# EAGLE design TRC1.0.0 (EAGLE 9.6.2)
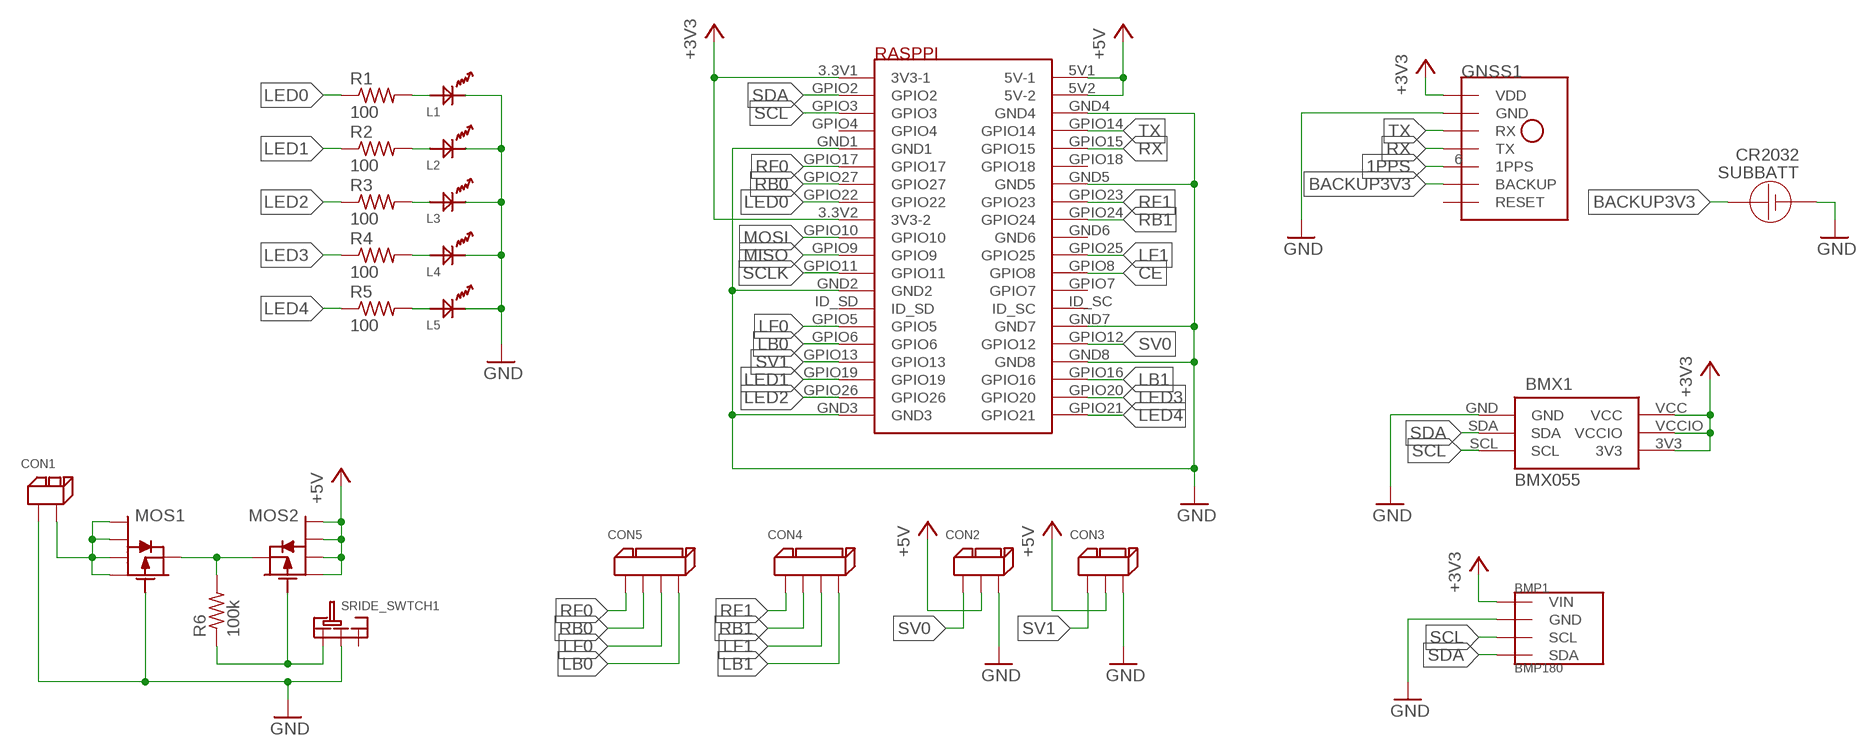
[diagram p0: schematic, sheet 1]

## Parts
BMP1  BMP180  [GY-68]
BMX1  BMX055  [BMX055]
CON1  2PIN  [2PIN]
CON2  3PIN  [3PIN]
CON3  3PIN  [3PIN]
CON4  4PIN  [4PIN]
CON5  4PIN  [4PIN]
GNSS1  GYSFDMAXB  [GYSFDMAXB]
L1  OSXX1608C1A  [OSXX1608C1A]
L2  OSXX1608C1A  [OSXX1608C1A]
L3  OSXX1608C1A  [OSXX1608C1A]
L4  OSXX1608C1A  [OSXX1608C1A]
L5  OSXX1608C1A  [OSXX1608C1A]
MOS1  PCH_SSM6J808R  [SSM6J808R]
MOS2  PCH_SSM6J808R  [SSM6J808R]
R1  100  R-US_R0201  [R0201]
R2  100  R-US_R0201  [R0201]
R3  100  R-US_R0201  [R0201]
R4  100  R-US_R0201  [R0201]
R5  100  R-US_R0201  [R0201]
R6  100k  R-US_R0201  [R0201]
RASPPI  RASPBERYPIZEROW  [RASPBERYPIZEROW]
SRIDE_SWTCH1  SRIDE_SWITCH  [SRIDE_SWITCH]
SUBBATT  CR2032  [CR2032]

## Nets
1PPS: GNSS1.6(1PPS)
+3V3: BMP1.P1(VIN) BMX1.3V3 BMX1.VCC BMX1.VCCIO GNSS1.16(VDD) RASPPI.3.3V1(3V3-1) RASPPI.3.3V2(3V3-2)
+5V: CON2.P$2 CON3.P$2 MOS2.1 MOS2.2 MOS2.5 MOS2.6 RASPPI.5V1(5V-1) RASPPI.5V2(5V-2)
BACKUP3V3: GNSS1.14(BACKUP) SUBBATT.VCC SUBBATT.VCC2(VCC)
CE: RASPPI.GPIO8
GND: BMP1.P2(GND) BMX1.GND CON1.P$1 CON2.P$3 CON3.P$3 GNSS1.1(GND) GNSS1.2(GND) GNSS1.7(GND) GNSS1.10(GND) GNSS1.12(GND) GNSS1.19(GND) GNSS1.20(GND) L1.CT L2.CT L3.CT L4.CT L5.CT MOS1.3 RASPPI.GND1 RASPPI.GND2 RASPPI.GND3 RASPPI.GND4 RASPPI.GND5 RASPPI.GND7 RASPPI.GND8 SRIDE_SWTCH1.LR SUBBATT.GND
LB0: CON5.P$4 RASPPI.GPIO6
LB1: CON4.P$4 RASPPI.GPIO16
LED0: R1.1 RASPPI.GPIO22
LED1: R2.1 RASPPI.GPIO19
LED2: R3.1 RASPPI.GPIO26
LED3: R4.1 RASPPI.GPIO20
LED4: R5.1 RASPPI.GPIO21
LF0: CON5.P$3 RASPPI.GPIO5
LF1: CON4.P$3 RASPPI.GPIO25
MISO: RASPPI.GPIO9
MOSI: RASPPI.GPIO10
N$1: L1.AN R1.2
N$2: L2.AN R2.2
N$3: L3.AN R3.2
N$4: L4.AN R4.2
N$5: L5.AN R5.2
N$6: MOS1.4 MOS2.4 R6.2
N$7: MOS2.3 R6.1 SRIDE_SWTCH1.L
N$8: CON1.P$2 MOS1.1 MOS1.2 MOS1.5 MOS1.6
RB0: CON5.P$2 RASPPI.GPIO27
RB1: CON4.P$2 RASPPI.GPIO24
RF0: CON5.P$1 RASPPI.GPIO17
RF1: CON4.P$1 RASPPI.GPIO23
RX: GNSS1.5(TX) RASPPI.GPIO15
SCL: BMP1.P3(SCL) BMX1.SCL RASPPI.GPIO3
SCLK: RASPPI.GPIO11
SDA: BMP1.P4(SDA) BMX1.SDA RASPPI.GPIO2
SV0: CON2.P$1 RASPPI.GPIO12
SV1: CON3.P$1 RASPPI.GPIO13
TX: GNSS1.3(RX) RASPPI.GPIO14
Unconnected: GNSS1.4(RESET) RASPPI.GND6 RASPPI.GPIO4 RASPPI.GPIO7 RASPPI.GPIO18 RASPPI.ID_SC RASPPI.ID_SD SRIDE_SWTCH1.R

## Library data of the parts
BMP1 = BMP180:BMP180
BMX1 = BMX055:BMX055
CON1 = XR Connector:2PIN
CON2 CON3 = XR Connector:3PIN
CON4 CON5 = XR Connector:4PIN
GNSS1 = GYSFDMAXB:GYSFDMAXB
L1-L5 = Chip LED:OSXX1608C1A
MOS1 MOS2 = Chip MOSFET:PCH_SSM6J808R
R1-R6 = rcl:R-US_: RESISTOR, American symbol; SPICEPREFIX: R
RASPPI = RaspberyPiZeroW:RASPBERYPIZEROW
SRIDE_SWTCH1 = Sride Switch:SRIDE_SWITCH
SUBBATT = CR2032:CR2032

## Board
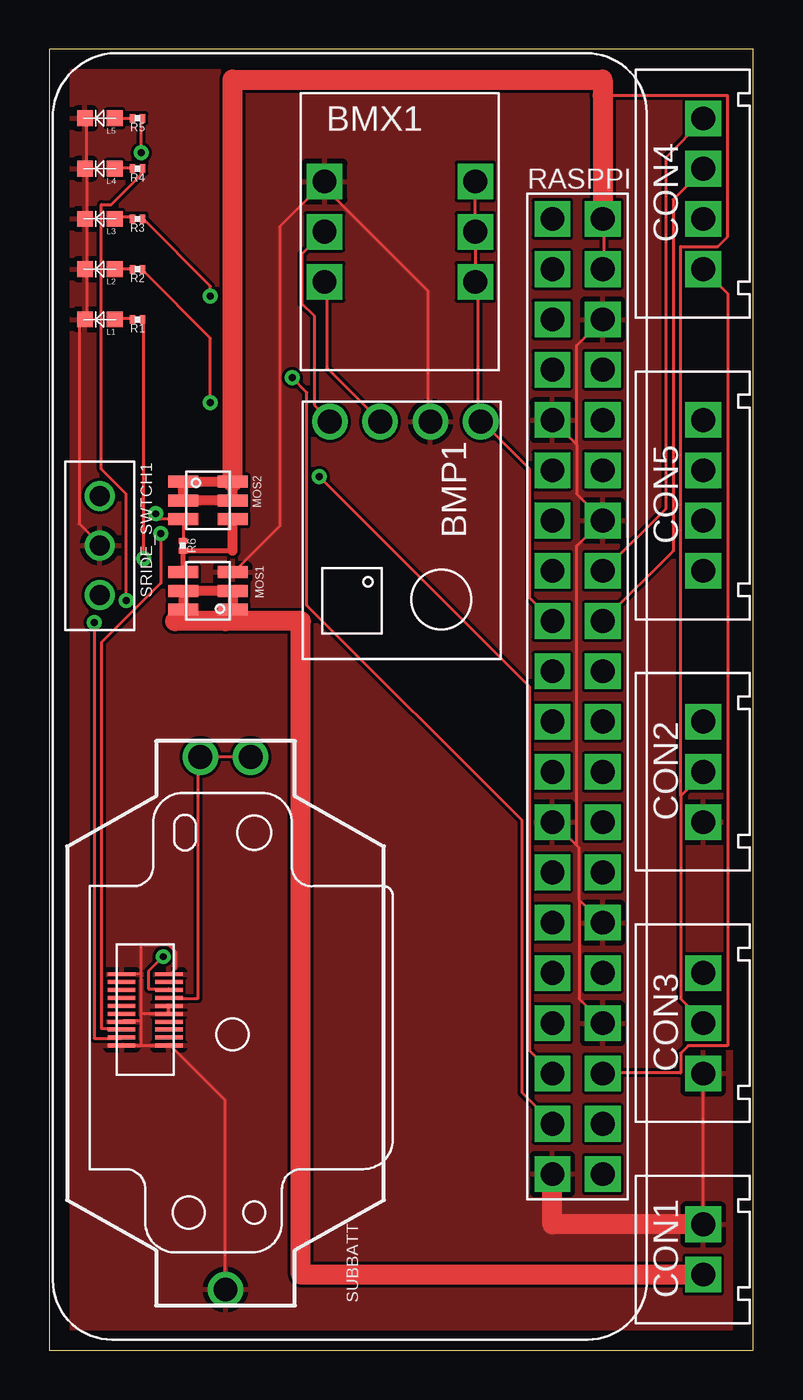
[diagram p1: board, top side]
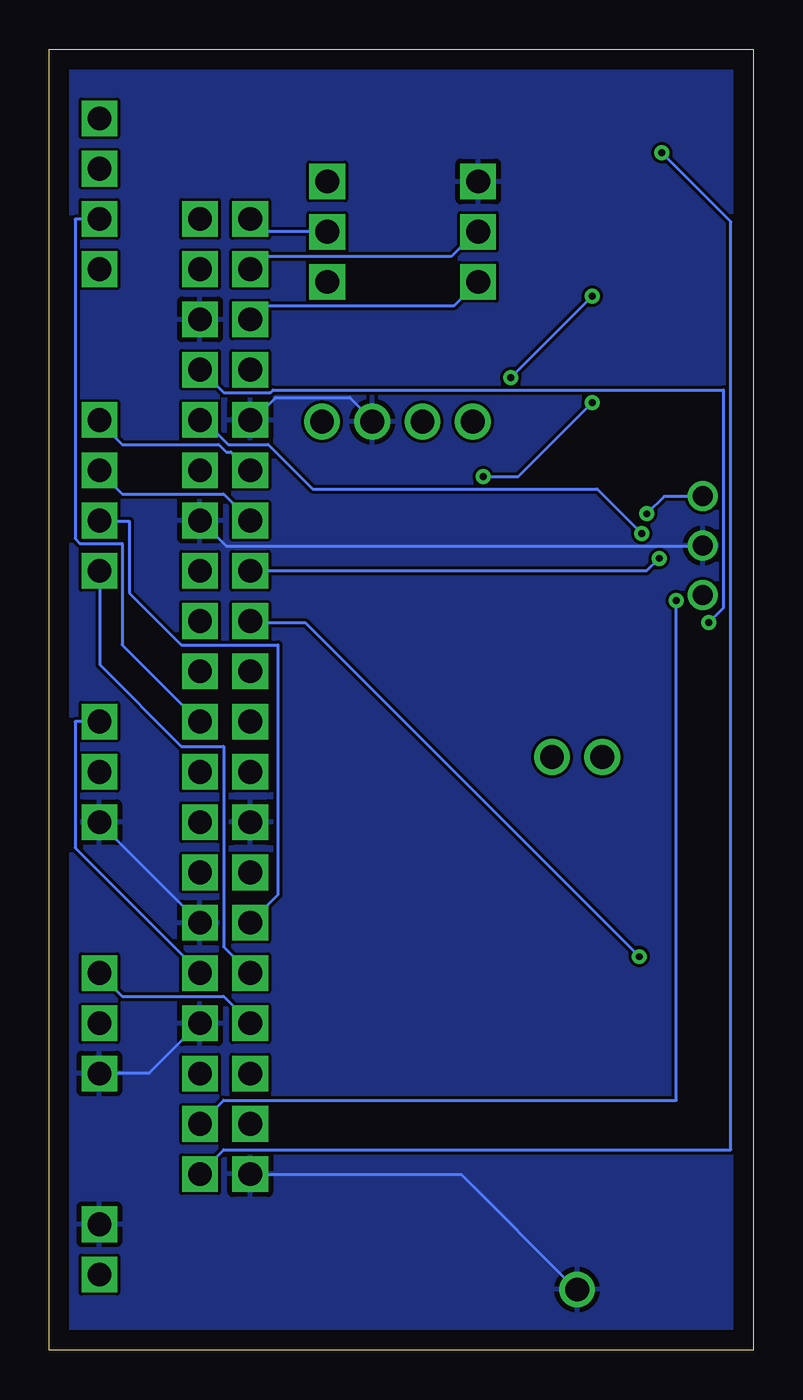
[diagram p2: board, bottom side, seen from below]

Size 35.54 x 65.71 mm. Coordinates in mm from the lower left corner, seen from the top.
Outline: 0,0 35.54,0 35.54,65.71 0,65.71 0,0
Copper layers (1*16): Top 0.035mm / dielectric 1.5mm / Bottom 0.035mm
Design rules "default": minimum track width 6mil, minimum drill 0.35mm, track to track 6mil, track to pad 6mil, pad to pad 6mil, via to via 6mil, smd to smd 6mil, copper to edge 40mil, drill to drill 6mil, minimum pad ring 10mil, minimum via ring 8mil, stop-mask expansion 4mil, vias tented up to drill 0mil, thermal gap 10mil

### Footprints (pad centres in the part's own frame; a part is rotated, then mirrored left to right if it is on the bottom)
GY-68 = drill 1.2: P1 -5,4; P2 -5,1.46; P3 -5,-1.08; P4 -5,-3.62
BMX055 = drill 1.2 pad 1.5 square: 3V3 8.81,-9.53; GND 1.19,-4.46; SCL 1.19,-9.53; SDA 1.19,-7; VCC 8.81,-4.46; VCCIO 8.81,-7
2PIN = drill 1.2 square: P$1 -1.27,0; P$2 1.27,0
3PIN = drill 1.2 square: P$1 2.54,-2.54; P$2 5.08,-2.54; P$3 7.62,-2.54
4PIN = drill 1.2 square: P$1 2.54,-2.54; P$2 5.08,-2.54; P$3 7.62,-2.54; P$4 10.16,-2.54
GYSFDMAXB = smd 0.2 x 1.39: 1 12.85,11.595; 2 12.85,9.205; 3 13.25,11.595; 4 13.25,9.205; 5 13.65,11.595; 6 13.65,9.205; 7 14.05,11.595; 8 14.05,9.205; 9 14.45,11.595; 10 14.45,9.205; 11 14.85,11.595; 12 14.85,9.205; 13 15.25,11.595; 14 15.25,9.205; 15 15.65,11.595; 16 15.65,9.205; 17 16.05,11.595; 18 16.05,9.205; 19 16.45,11.595; 20 16.45,9.205
OSXX1608C1A = smd 0.8 x 0.8: AN -0.75,0; CT 0.75,0
SSM6J808R = smd 0.6 x 1.5: 1 -0.95,-1.25; 2 0,-1.25; 3 0.95,-1.25; 4 0.95,1.25; 5 0,1.25; 6 -0.95,1.25
R0201 = smd 0.28 x 0.43: 1 -0.255,0; 2 0.255,0
RASPBERYPIZEROW = drill 1.2 pad 1.676 square: 3.3V1 -1.27,24.13; 3.3V2 -1.27,3.81; 5V1 1.27,24.13; 5V2 1.27,21.59; GND1 -1.27,13.97; GND2 -1.27,-6.35; GND3 -1.27,-24.13; GND4 1.27,19.05; GND5 1.27,8.89; GND6 1.27,1.27; GND7 1.27,-11.43; GND8 1.27,-16.51; GPIO2 -1.27,21.59; GPIO3 -1.27,19.05; GPIO4 -1.27,16.51; GPIO5 -1.27,-11.43; GPIO6 -1.27,-13.97; GPIO7 1.27,-6.35; GPIO8 1.27,-3.81; GPIO9 -1.27,-1.27; GPIO10 -1.27,1.27; GPIO11 -1.27,-3.81; GPIO12 1.27,-13.97; GPIO13 -1.27,-16.51; GPIO14 1.27,16.51; GPIO15 1.27,13.97; GPIO16 1.27,-19.05; GPIO17 -1.27,11.43; GPIO18 1.27,11.43; GPIO19 -1.27,-19.05; GPIO20 1.27,-21.59; GPIO21 1.27,-24.13; GPIO22 -1.27,6.35; GPIO23 1.27,6.35; GPIO24 1.27,3.81; GPIO25 1.27,-1.27; GPIO26 -1.27,-21.59; GPIO27 -1.27,8.89; ID_SC 1.27,-8.89; ID_SD -1.27,-8.89
SRIDE_SWITCH = drill 1: L -2.5,0; LR 0,0; R 2.5,0
CR2032 = drill 1.2: GND -13.45,0; VCC 13.45,-1.27; VCC2 13.45,1.27

### Placement (x,y rotation side)
BMP1  17.78,41.91 270 top
BMX1  12.7,63.5 0 top
CON1  33.02,5.08 270 top
CON2  35.56,34.29 270 top
CON3  35.56,21.59 270 top
CON4  35.56,64.77 270 top
CON5  35.56,49.53 270 top
GNSS1  15.24,2.54 90 top
L1  2.54,52.07 180 top
L2  2.54,54.61 180 top
L3  2.54,57.15 180 top
L4  2.54,59.69 180 top
L5  2.54,62.23 180 top
MOS1  8,38.35 90 top
MOS2  8,42.93 270 top
R1  4.45,52.07 180 top
R2  4.45,54.61 180 top
R3  4.45,57.15 180 top
R4  4.45,59.69 180 top
R5  4.45,62.23 180 top
R6  6.73,40.64 270 top
RASPPI  26.67,33.02 0 top
SRIDE_SWTCH1  2.54,40.64 270 top
SUBBATT  8.89,16.51 90 top

### Tracks (layer width: path | path; a pad name or v marks a point on that pad's centre or on a via)
+3V3  (via drill 0.35)
  Top 0.152: BMX1.VCCIO 21.5,54 BMX1.3V3 21.62,53.88 21.62,47.12 21.75,47 BMP1.P1 21.88,46.88 24.25,44.5 24.25,38 25.38,36.88 RASPPI.3.3V2 | BMX1.VCCIO 21.5,59 BMX1.VCC | BMX1.VCCIO | v5.75,19.88 5,19.12 5,18.25 6,18.25 GNSS1.16
  Bottom 0.152: RASPPI.3.3V1 24.75,56.5 BMX1.VCCIO | v5.75,19.88 22.62,36.75 25.38,36.75 RASPPI.3.3V2
+5V
  Top 0.152: RASPPI.5V2 28,54.62 28,56.75 RASPPI.5V1 | 31.88,28 31.88,17.75 33,16.62 CON3.P$2 | 31.88,28 33,29.12 CON2.P$2 | 27.94,63.38 34.25,63.38 34.25,56.25 33.75,55.75 31.88,55.75 31.88,28
  Top 0.508: MOS2.2 MOS2.1 MOS2.6 MOS2.5 MOS2.2
  Top 1.016: MOS2.6 9.25,64.19 27.94,64.19 27.94,63.38 RASPPI.5V1
BACKUP3V3
  Top 0.152: GNSS1.14 6.12,17.75 7.5,17.75 7.5,29.88 SUBBATT.VCC2 7.62,30 10.12,30 SUBBATT.VCC
GND
  Top 0.152: 13.75,58.88 13.88,59 BMX1.GND 13.75,58.88 | 13.75,58.88 11.62,56.75 11.62,41.62 9.38,39.38 MOS1.3 | L5.CT 1.88,62.12 1.88,59.75 L4.CT 1.88,59.62 1.88,57.25 L3.CT 1.88,57.12 1.88,54.62 L2.CT 1.88,54.5 1.88,52.12 L1.CT 1.75,52 1.5,51.75 1.5,41.75 2.5,40.75 SRIDE_SWTCH1.LR | 26.62,45.75 26.62,43.25 27.88,42 RASPPI.GND5 27.88,41.88 26.62,40.62 26.62,25.5 | 26.62,45.75 25.5,46.88 RASPPI.GND1 | 26.62,45.75 26.62,50.75 27.88,52 RASPPI.GND4 | 13.75,58.88 19.12,53.5 19.12,47 BMP1.P2 | 6,17 6,17.38 GNSS1.12 | 4.62,15.38 6,15.38 GNSS1.2 6.12,15.38 8.88,12.62 8.88,3.12 SUBBATT.GND | 4.62,15.38 3.75,15.38 GNSS1.1 | 4.62,16.62 3.75,16.62 GNSS1.7 | 4.62,15.38 4.62,16.62 | 4.62,19 3.75,19 GNSS1.19 | 4.62,16.62 4.62,17 | 4.62,17 4.62,19 | 4.62,19 4.62,20.5 6,20.5 6.38,20.12 6.38,19.25 6.12,19 GNSS1.20 | 4.62,17 6,17 | 6,17 GNSS1.10 | 26.62,25.5 26.75,25.38 26.75,22.75 | 26.62,25.5 25.5,26.62 RASPPI.GND2 | 26.75,22.75 27.88,21.62 RASPPI.GND7 | 26.75,22.75 26.75,17.75 27.88,16.62 RASPPI.GND8 | CON1.P$1 33,6.75 33,13.88 CON3.P$3
  Top 1.016: CON1.P$1 25.4,6.35 RASPPI.GND3
  Bottom 0.152: BMP1.P2 19.25,47 20.38,48.12 24.12,48.12 25.25,47 25.38,47 RASPPI.GND1 | SRIDE_SWTCH1.LR 2.62,40.62 26.62,40.62 27.88,41.88 RASPPI.GND5 | RASPPI.GND8 28,16.5 30.5,14 33,14 CON3.P$3 | RASPPI.GND7 28,21.62 33,26.62 CON2.P$3 | SUBBATT.GND 9,3.12 14.75,8.88 25.38,8.88 RASPPI.GND3
  pour Top: -1.27,67.31 36.83,67.31 36.83,-1.27 -1.27,-1.27
  pour Bottom: -1.27,67.31 36.83,67.31 36.83,-1.27 -1.27,-1.27
LB0
  Bottom 0.152: RASPPI.GPIO6 25.5,19.12 26.75,20.38 26.75,30.5 28.88,30.5 33,34.62 33,39.25 CON5.P$4
LB1
  Top 0.152: RASPPI.GPIO16 28,14 31.88,14 31.88,15 32.25,15.38 34.25,15.38 34.25,53.38 33.12,54.5 CON4.P$4
LED0  (via drill 0.35)
  Top 0.152: v4.75,40 4.75,52 R1.1
  Bottom 0.152: v4.75,40 5.38,39.38 25.38,39.38 RASPPI.GPIO22
LED1  (via drill 0.35)
  Top 0.152: v8.12,47.88 8.12,51.12 4.75,54.5 R2.1 | v13.62,44.12 24.25,33.5 24.25,15.12 25.38,14 RASPPI.GPIO19
  Bottom 0.152: v8.12,47.88 11.88,44.12 v13.62,44.12
LED2  (via drill 0.35)
  Top 0.152: v8.12,53.25 8.12,53.75 4.75,57.12 R3.1 | v12.25,49.12 13,48.38 13,37.62 23.88,26.75 23.88,13 25.38,11.5 RASPPI.GPIO26
  Bottom 0.152: v12.25,49.12 v8.12,53.25
LED3  (via drill 0.35)
  Top 0.152: v3.88,37.88 3.88,43.25 2.62,44.5 2.62,57.88 3.12,57.88 4.62,59.38 4.62,59.62 R4.1
  Bottom 0.152: v3.88,37.88 3.88,12.62 26.75,12.62 27.88,11.5 RASPPI.GPIO20
LED4  (via drill 0.35)
  Top 0.152: v4.62,60.5 4.62,62.12 R5.1
  Bottom 0.152: v4.62,60.5 1.12,57 1.12,10.12 26.75,10.12 27.88,9 RASPPI.GPIO21
LF0
  Bottom 0.152: RASPPI.GPIO5 25.38,21.62 24,23 24,35.62 28.88,35.62 31.5,38.25 31.5,41.88 33,41.88 CON5.P$3
LF1
  Bottom 0.152: RASPPI.GPIO25 28,31.75 31.88,35.62 31.88,40.75 34,40.75 34.25,41 34.25,57.12 33.12,57.12 CON4.P$3
N$1
  Top 0.152: R1.2 4.12,52.12 3.38,52.12 L1.AN
N$2
  Top 0.152: R2.2 4.12,54.62 3.38,54.62 L2.AN
N$3
  Top 0.152: R3.2 4.12,57.25 3.38,57.25 L3.AN
N$4
  Top 0.152: R4.2 4.12,59.75 3.38,59.75 L4.AN
N$5
  Top 0.152: R5.2 4.12,62.25 3.38,62.25 L5.AN
N$6
  Top 0.254: 6.73,39.3 R6.2 9.25,40.38
  Top 0.508: MOS1.4 6.73,39.3 | 9.25,40.38 MOS2.4
N$7  (via drill 0.35)
  Top 0.152: R6.1 6.75,41 6.75,41.88 MOS2.3 6.75,42 5.38,42 v5.38,42.25
  Bottom 0.152: v5.38,42.25 4.5,43.12 2.62,43.12 SRIDE_SWTCH1.L
N$8
  Top 0.508: 6.35,36.83 6.35,37.4 MOS1.6 MOS1.5 MOS1.2 MOS1.1 8.89,37.4 8.89,36.83
  Top 1.016: CON1.P$2 12.7,3.81 12.7,36.83 8.89,36.83 6.35,36.83
RB0
  Bottom 0.152: RASPPI.GPIO27 25.5,42 26.75,43.25 31.88,43.25 33,44.38 CON5.P$2
RB1
  Top 0.152: RASPPI.GPIO24 28,36.88 31.5,40.38 31.5,58.12 33,59.62 CON4.P$2
RF0
  Bottom 0.152: RASPPI.GPIO17 25.5,44.5 26.38,45.38 26.62,45.38 27,45.75 31.88,45.75 33,46.88 CON5.P$1
RF1
  Top 0.152: RASPPI.GPIO23 28,39.38 31.12,42.5 31.12,60.25 33,62.12 CON4.P$1
RX  (via drill 0.35)
  Top 0.152: v5.62,41.25 5.62,38.75 2.62,35.75 2.62,16.25 3.62,16.25 GNSS1.5
  Bottom 0.152: v5.62,41.25 7.88,43.5 22.25,43.5 24.5,45.75 26.5,45.75 27.62,46.88 27.88,46.88 RASPPI.GPIO15
SCL
  Top 0.152: BMP1.P3 16.62,47 14,49.62 14,53.88 BMX1.SCL
  Bottom 0.152: RASPPI.GPIO3 25.38,52.12 24.75,52.75 15.12,52.75 14,53.88 BMX1.SCL
SDA
  Top 0.152: BMP1.P4 14.12,47 13.38,47.75 13.38,52.25 12.75,52.88 12.75,55.38 13.88,56.5 BMX1.SDA
  Bottom 0.152: RASPPI.GPIO2 25.38,54.62 24.75,55.25 15.25,55.25 14,56.5 BMX1.SDA
SV0
  Bottom 0.152: CON2.P$1 34.25,31.75 34.25,25.38 28,19.12 RASPPI.GPIO12
SV1
  Bottom 0.152: RASPPI.GPIO13 25.5,16.62 26.75,17.88 31.88,17.88 33,19 CON3.P$1
TX  (via drill 0.35)
  Top 0.152: v2.25,36.75 2.25,15.75 3.62,15.75 GNSS1.3
  Bottom 0.152: v2.25,36.75 1.5,37.5 1.5,48.5 24.25,48.5 24.38,48.38 26.75,48.38 27.88,49.5 RASPPI.GPIO14